# EAGLE design Copernicus-DIP-Breakout (EAGLE 6.4)
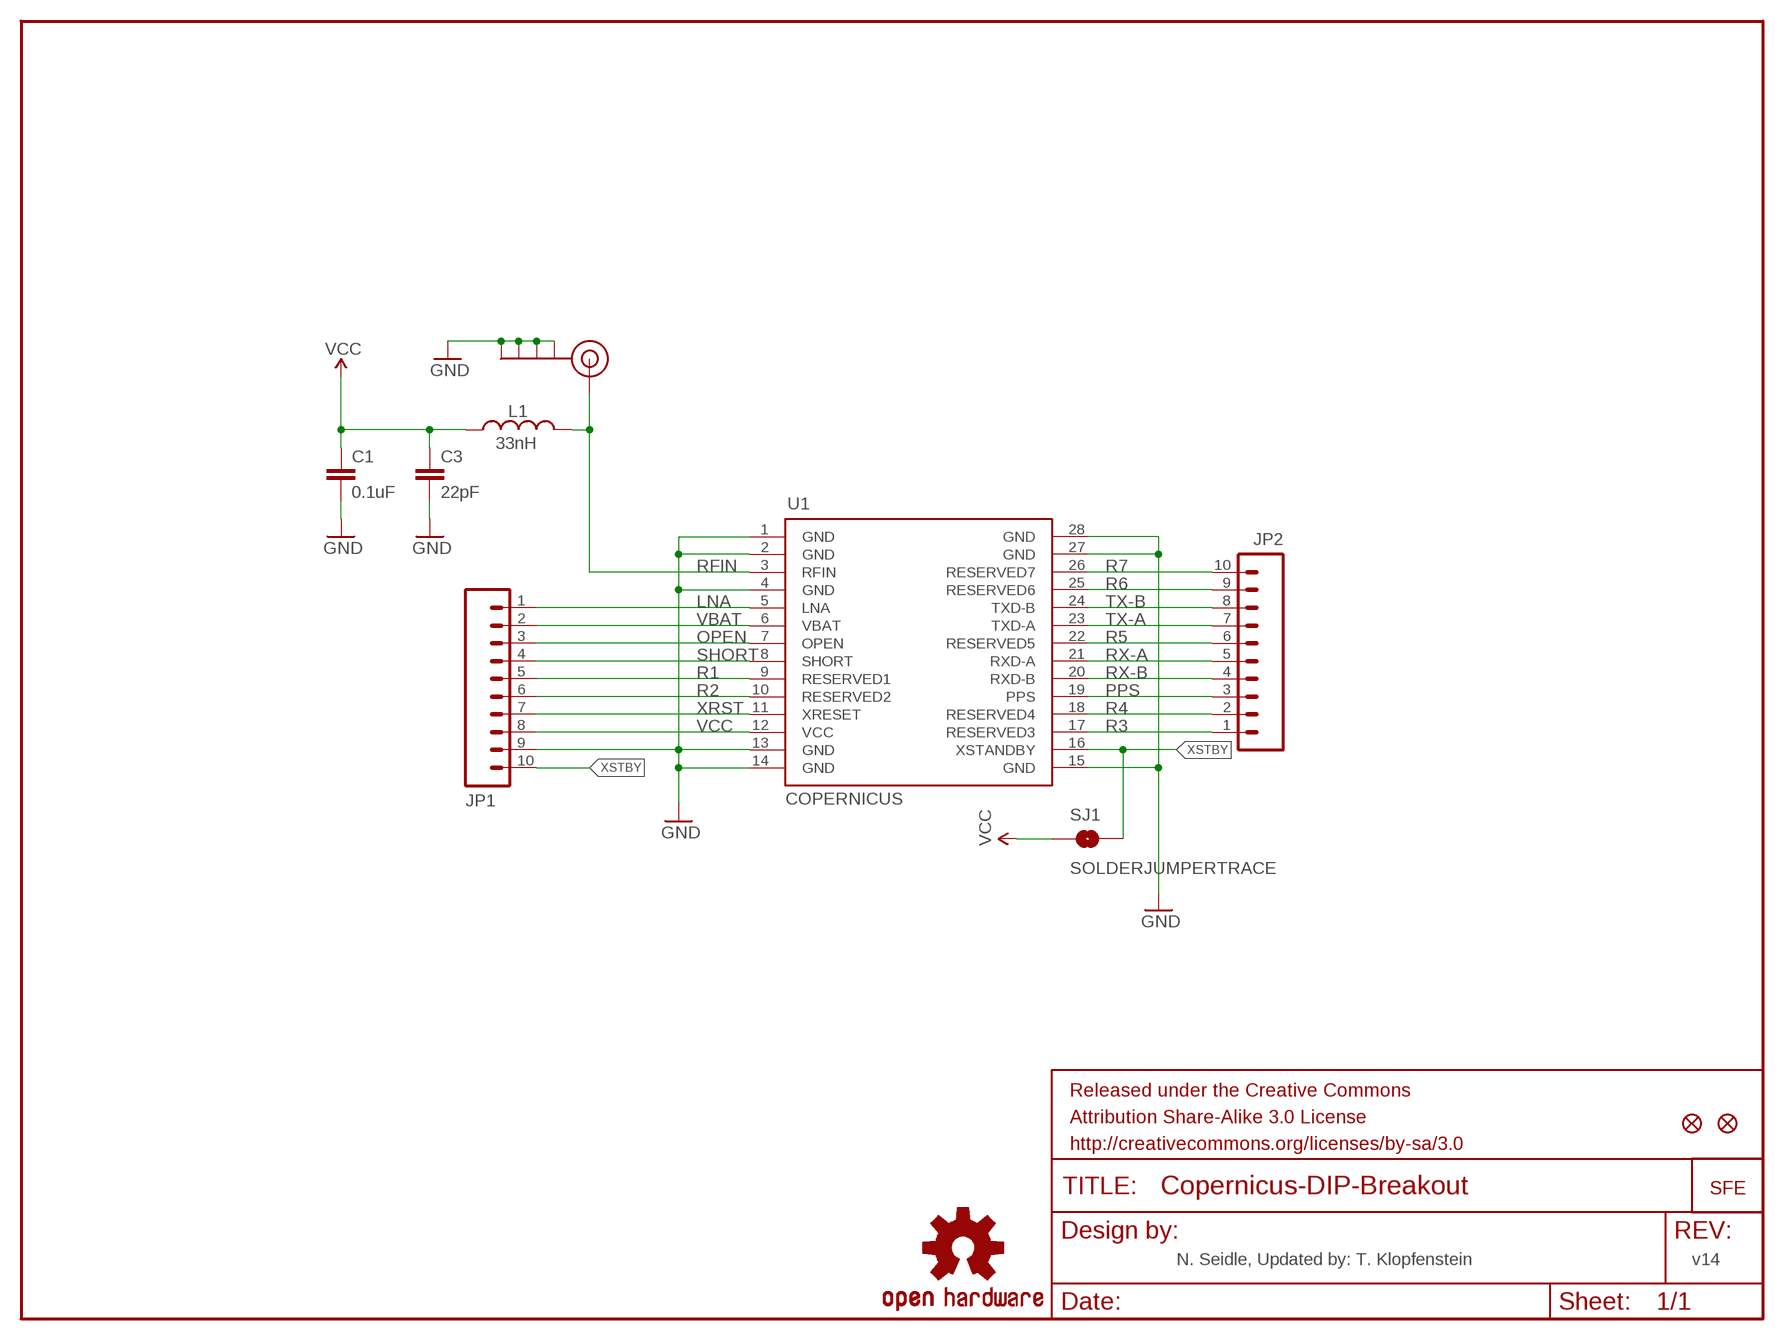
[diagram p0: schematic, sheet 1]

## Parts
C1  0.1uF  CAP0603-CAP  [0603-CAP]
C3  22pF  CAP0603-CAP  [0603-CAP]
FRAME1  FRAME-LETTER  [CREATIVE_COMMONS]
JP1  M10"  [1X10]
JP2  M10"  [1X10]
JP3  SMA_EDGE  [SMA_EDGE]
JP4  LOGO-SFESK  [SFE-LOGO-FLAME]
L1  33nH  INDUCTOR0603  [0603]
SJ1  SOLDERJUMPERTRACE  [SJ_2S-TRACE]
U1  COPERNICUS  COPERNICUSSMD  [COPERNICUS]
U$1  OSHW-LOGOS  [OSHW-LOGO-S]
U$2  FIDUCIAL1X2  [FIDUCIAL-1X2]
U$3  FIDUCIAL1X2  [FIDUCIAL-1X2]

## Nets
GND: C1.2 C3.2 JP1.9 JP3.GND@0(GND) JP3.GND@1(GND) JP3.GND@2(GND) JP3.GND@3(GND) U1.1(GND) U1.2(GND) U1.4(GND) U1.13(GND) U1.14(GND) U1.15(GND) U1.27(GND) U1.28(GND)
LNA: JP1.1 U1.5(LNA)
OPEN: JP1.3 U1.7(OPEN)
PPS: JP2.3 U1.19(PPS)
R1: JP1.5 U1.9(RESERVED1)
R2: JP1.6 U1.10(RESERVED2)
R3: JP2.1 U1.17(RESERVED3)
R4: JP2.2 U1.18(RESERVED4)
R5: JP2.6 U1.22(RESERVED5)
R6: JP2.9 U1.25(RESERVED6)
R7: JP2.10 U1.26(RESERVED7)
RFIN: JP3.SIG(SIGNAL) L1.2 U1.3(RFIN)
RX-A: JP2.5 U1.21(RXD-A)
RX-B: JP2.4 U1.20(RXD-B)
SHORT: JP1.4 U1.8(SHORT)
TX-A: JP2.7 U1.23(TXD-A)
TX-B: JP2.8 U1.24(TXD-B)
VBAT: JP1.2 U1.6(VBAT)
VCC: C1.1 C3.1 JP1.8 L1.1 SJ1.1 U1.12(VCC)
XRST: JP1.7 U1.11(XRESET)
XSTBY: JP1.10 SJ1.2 U1.16(XSTANDBY)

## Notes on the sheet
- N. Seidle, Updated by: T. Klopfenstein | v14

## Library data of the parts
C1 C3 = SparkFun-Passives:CAP: Capacitor Standard 0603 ceramic capacitor, and 0.1" leaded capacitor.
FRAME1 = SparkFun-Aesthetics:FRAME-LETTER: Schematic Frame Standard 8.5x11 US Letter frame
JP1 JP2 = SparkFun:M10: Header 10 Standard 10-pin 0.1" header. Use with straight break away headers (SKU : PRT-00116), right angle break away headers (PRT-00553), swiss pins (PRT-00743), machine pins (PRT-00117), and female headers (PRT-00115).
JP3 = SparkFun-Nate:SMA_EDGE
JP4 = SparkFun-Aesthetics:LOGO-SFE: Spark Fun Electronics PCB Logo This is the standard Spark Fun Electronics PCB logo.
L1 = SparkFun-Passives:INDUCTOR: Inductors Basic Inductor/Choke - 0603 and 1206. Footprints are not proven and vary greatly between part numbers.
SJ1 = SparkFun-Passives:SOLDERJUMPER: Solder Jumper Standard SMD solder jumper. Used to automate production. Two varients : Normally Open and Normally Closed are the same, but have different paste layers. NC will have a large amount of paste and should jumper during reflow.
U1 = SparkFun-RF:COPERNICUS: Copernicus II GPS- Trimble recommended layout and paste layer. Footprint production proven. Spark Fun Electronics SKU : GPS-07951
U$1 = SparkFun-Aesthetics:OSHW-LOGO: Open Source Hardware Logo This logo indicates the piece of hardware it is found on incorporates a OSHW license and/or adheres to the definition of open source hardware found here: http://freedomdefined.org/OSHW
U$2 U$3 = SparkFun:FIDUCIAL: Fiducial Alignment Points Various fiducial points for machine vision alignment.

## Net classes
0 default: width 0.254 mm
1 power: width 0.305 mm

## Board
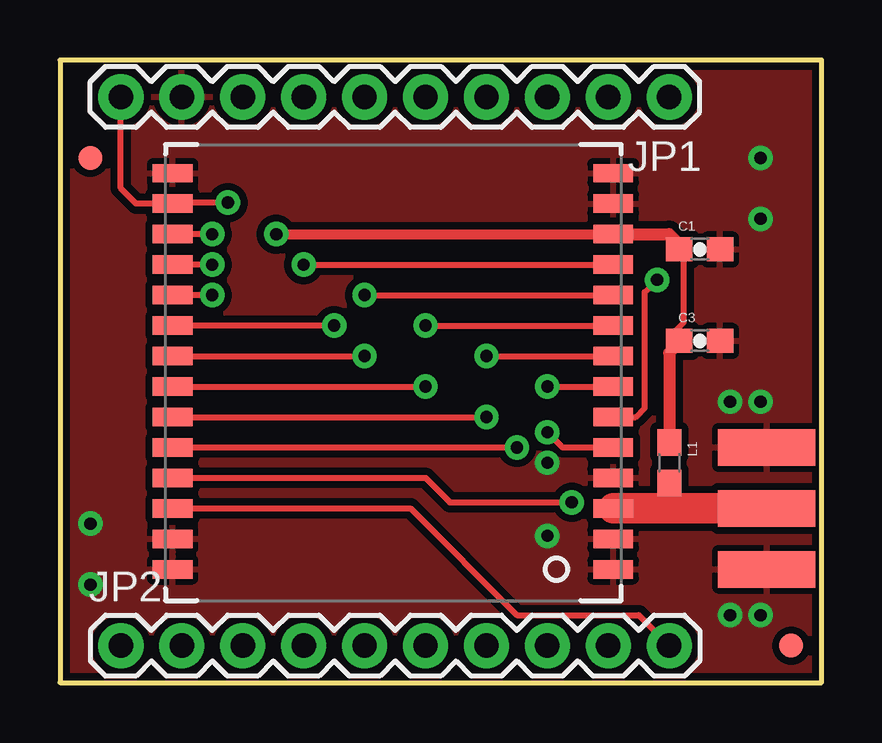
[diagram p1: board, top side]
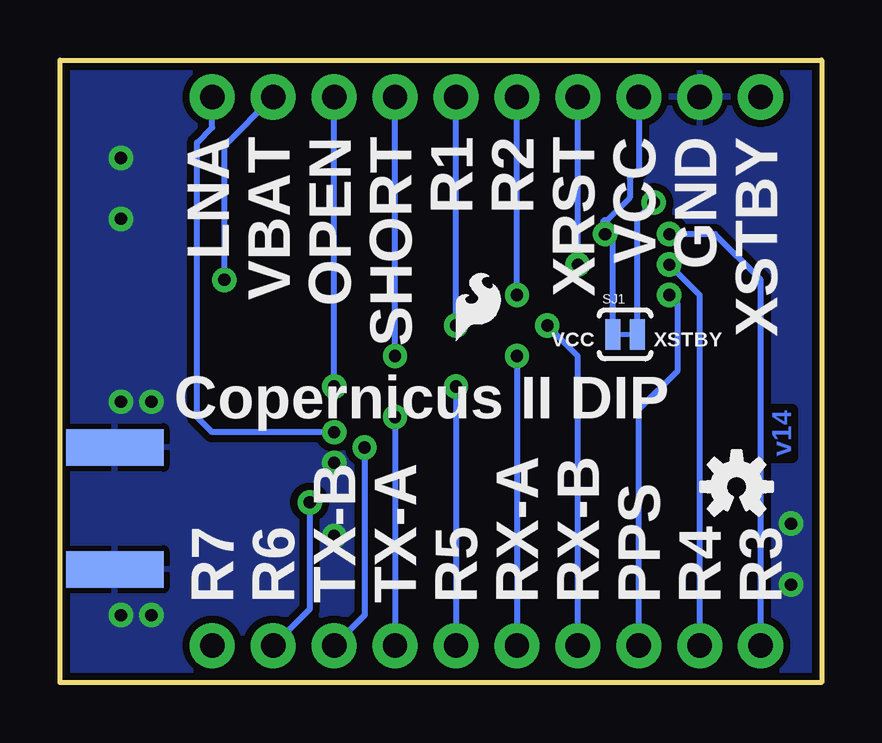
[diagram p2: board, bottom side, seen from below]

Size 31.75 x 25.94 mm. Coordinates in mm from the lower left corner, seen from the top.
Outline: 0,0 31.75,0 31.75,25.94 0,25.94 0,0
Copper layers (1*16): Top 0.035mm / dielectric 1.5mm / Bottom 0.035mm
Design rules "SparkFun": minimum track width 8mil, minimum drill 20mil, track to track 8mil, track to pad 8mil, pad to pad 8mil, via to via 8mil, smd to smd 8mil, copper to edge 8mil, drill to drill 8mil, minimum pad ring 12mil, minimum via ring 10mil, stop-mask expansion 4mil, vias tented up to drill 20mil, thermal gap 10mil

### Footprints (pad centres in the part's own frame; a part is rotated, then mirrored left to right if it is on the bottom)
0603-CAP = smd 1.1 x 1: 1 -0.85,0; 2 0.85,0
1X10 = drill 1.016 pad 1.88: 1 0,0; 2 2.54,0; 3 5.08,0; 4 7.62,0; 5 10.16,0; 6 12.7,0; 7 15.24,0; 8 17.78,0; 9 20.32,0; 10 22.86,0
SMA_EDGE = smd 1.524 x 4.064: GND@0 0,0; GND@1 5.08,0; SIG 2.54,0 | smd 1.524 x 4.064 bottom: GND@2 0,0; GND@3 5.08,0
0603 = smd 1.1 x 1: 1 -0.85,0; 2 0.85,0
SJ_2S-TRACE = smd 0.635 x 1.27: 1 -0.508,0; 2 0.508,0
COPERNICUS = smd 0.762 x 1.651: 1 0,-18.364; 2 1.27,-18.364; 3 2.54,-18.364; 4 3.81,-18.364; 5 5.08,-18.364; 6 6.35,-18.364; 7 7.62,-18.364; 8 8.89,-18.364; 9 10.16,-18.364; 10 11.43,-18.364; 11 12.7,-18.364; 12 13.97,-18.364; 13 15.24,-18.364; 14 16.51,-18.364; 15 16.51,0; 16 15.24,0; 17 13.97,0; 18 12.7,0; 19 11.43,0; 20 10.16,0; 21 8.89,0; 22 7.62,0; 23 6.35,0; 24 5.08,0; 25 3.81,0; 26 2.54,0; 27 1.27,0; 28 0,0
FIDUCIAL-1X2 = smd 1 x 1: 1 0,0

### Placement (x,y rotation side)
C1  26.67,18.05 0 top
C3  26.67,14.24 0 top
FRAME1  11.16,-22.86 0 top  (outside the outline)
JP1  25.4,24.4 180 top
JP2  2.54,1.54 0 top
JP3  29.46,9.79 270 top
JP4  15.24,14.24 0 bottom
L1  25.4,9.16 270 top
SJ1  8.19,14.51 0 bottom
U1  4.7,4.71 90 top
U$1  3.54,8.16 0 bottom
U$2  1.27,21.86 0 top
U$3  30.48,1.54 0 top

### Tracks (layer width: path | path; a pad name or v marks a point on that pad's centre or on a via)
GND  (via drill 0.51)
  other vias: 20.32,9.16 20.32,6.11 29.21,2.81 29.21,11.7 27.94,11.7 27.94,2.81 1.27,4.08 1.27,6.62 29.21,21.86 29.21,19.32
  pour Bottom (isolate 0.305): 0,25.94 31.75,25.94 31.75,0 0,0
  pour Top (isolate 0.305): 31.75,25.94 31.75,0 0,0 0,25.94
LNA  (via drill 0.51)
  Top 0.254: U1.5 20.95,9.79 v20.32,10.43
  Bottom 0.254: v20.32,10.43 25.4,10.43 26.04,11.06 26.04,22.5 25.4,23.13 JP1.1
OPEN  (via drill 0.51)
  Top 0.254: v20.32,12.34 U1.7
  Bottom 0.254: v20.32,12.34 JP1.3
PPS  (via drill 0.51)
  Top 0.254: v6.35,16.14 U1.19
  Bottom 0.254: JP2.3 7.62,11.38 6,13 6,15.79 v6.35,16.14
R1  (via drill 0.51)
  Top 0.254: v15.24,14.88 U1.9
  Bottom 0.254: v15.24,14.88 JP1.5
R2  (via drill 0.51)
  Top 0.254: v12.7,16.14 U1.10
  Bottom 0.254: v12.7,16.14 JP1.6
R3  (via drill 0.51)
  Top 0.254: v6.35,18.68 U1.17
  Bottom 0.254: JP2.1 2.54,16.78 4.45,18.68 v6.35,18.68
R4  (via drill 0.51)
  Top 0.254: v6.35,17.41 U1.18
  Bottom 0.254: JP2.2 5.08,16.14 v6.35,17.41
R5  (via drill 0.51)
  Top 0.254: U1.22 v15.24,12.34
  Bottom 0.254: v15.24,12.34 JP2.6
R6  (via drill 0.51)
  Top 0.254: v21.34,7.51 16.26,7.51 15.24,8.53 U1.25
  Bottom 0.254: v21.34,7.51 21.34,3.06 JP2.9
R7
  Top 0.254: U1.26 14.61,7.25 19.05,2.81 24.13,2.81 JP2.10
RFIN
  Top 0.508: 25.4,7.13 25.4,7.25 L1.2
  Top 1.27: U1.3 25.4,7.25 JP3.SIG
RX-A  (via drill 0.51)
  Top 0.254: U1.21 v12.7,13.61
  Bottom 0.254: v12.7,13.61 JP2.5
RX-B  (via drill 0.51)
  Top 0.254: v11.43,14.88 U1.20
  Bottom 0.254: JP2.4 10.16,13.61 v11.43,14.88
SHORT  (via drill 0.51)
  Top 0.254: v17.78,13.61 U1.8
  Bottom 0.254: v17.78,13.61 JP1.4
TX-A  (via drill 0.51)
  Top 0.254: U1.23 v17.78,11.06
  Bottom 0.254: v17.78,11.06 JP2.7
TX-B  (via drill 0.51)
  Top 0.254: U1.24 v19.05,9.79
  Bottom 0.254: v19.05,9.79 19.05,2.81 JP2.8
VBAT  (via drill 0.51)
  Top 0.254: U1.6 24,11.06 24.38,11.45 24.38,16.27 v24.89,16.78
  Bottom 0.254: v24.89,16.78 24.89,22.37 JP1.2
VCC  (via drill 0.51)
  Top 0.254: C3.1 25.67,14.24 25.4,13.97 25.4,14.4 26,15 26,17.87 C1.1
  Top 0.406: v9.02,18.68 U1.12
  Top 0.508: C3.1 25.91,14.24 25.4,13.73 L1.1 | 26.02,17.91 26.04,17.92 26.02,17.94 C1.1 26.04,18.05 25.4,18.68 U1.12
  Bottom 0.254: SJ1.1 8.7,18.37 v9.02,18.68 | JP1.8 7.62,21.38 8,21 8,20.21 9.02,19.19
  Bottom 0.406: v9.02,18.68 9.02,19.19
XRST  (via drill 0.51)
  Top 0.254: v10.16,17.41 U1.11
  Bottom 0.254: v10.16,17.41 JP1.7
XSTBY  (via drill 0.51)
  Top 0.254: JP1.10 2.54,20.59 3.17,19.95 U1.16 4.74,20 v7,20
  Bottom 0.254: SJ1.2 7.68,19.32 v7,20

### Text on the board
Bottom: v14
bPlace: XSTBY | GND | VCC | XRST | R2 | R1 | SHORT | OPEN | VBAT | LNA | XSTBY | VCC | Copernicus II DIP | R3 | R4 | PPS | RX-B | RX-A | R5 | TX-A | TX-B | R6 | R7
tValues: N. Seidle, Updated by: T. Klopfenstein
Measures: 0.00 | 100.00 | 200.00 | 300.00 | 400.00 | 500.00 | 600.00 | 700.00 | 800.00 | 900.00 | 1000.00 | 1000.00 | 900.00 | 100.00 | 0.00 | 0.00 | All Dimensions in mil | 1250.00 | Spark Fun Electronics